# EasyEDA schematic 1-Schematic_New Project.json
TITLE: Sheet_1; REV: 1.0; Date: 2021-07-25; Sheet: 1/1; Drawn By: Felipe Grings; Company: Your Company
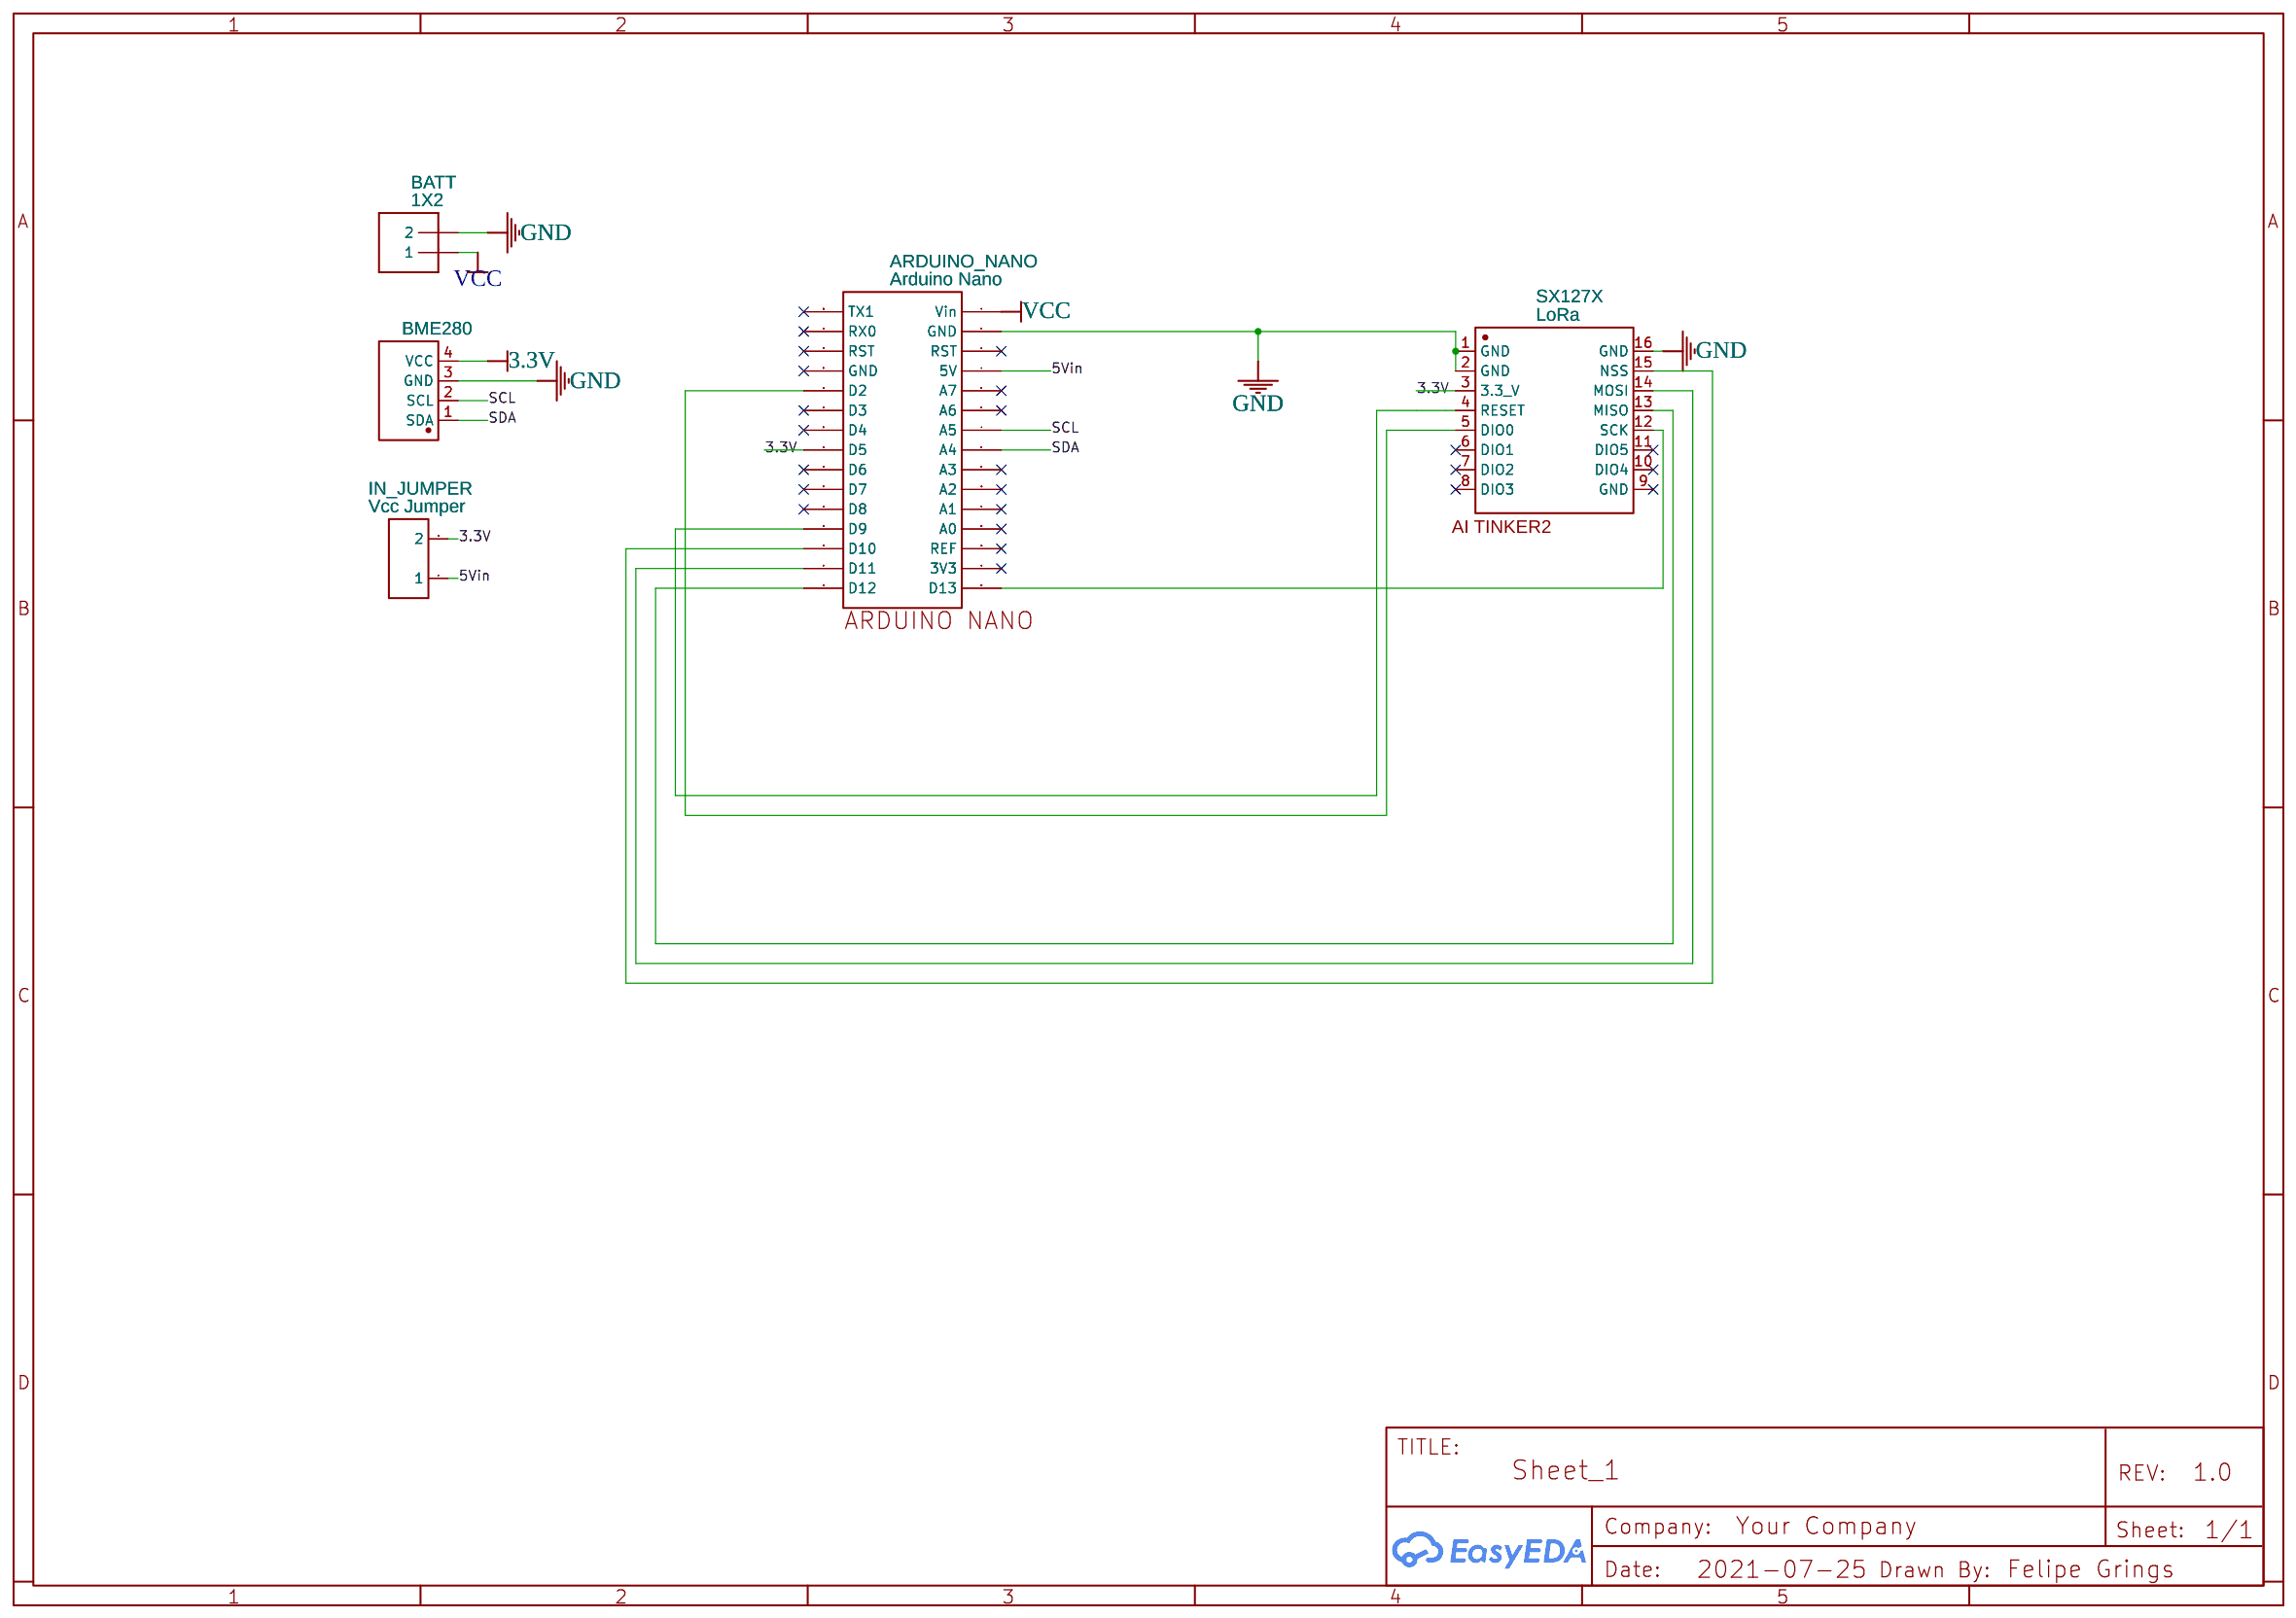
[diagram p0: schematic sheet]

## Parts
ARDUINO_NANO  Arduino Nano  [ARDUINO NANO]
BATT  1X2  [1X2-3.5MM]
IN_JUMPER  Vcc Jumper  [HDR-TH_2P-P2.54-V-M-1]
SDA  BME280  [GYBMEP]
SX127X  LoRa  [AI TINKER2]

## Library data of the parts
ARDUINO_NANO = Arduino Nano: Contributor: hctan22
BATT = 1X2: Contributor: Adafruit
IN_JUMPER = Header-Male-2.54_1x2: Supplier: LCSC; Manufacturer: TE Connectivity; Manufacturer Part: 826629-2; Supplier Part: C86471; JLCPCB Part Class: Extended Part
SDA = GYBMEP: Contributor: MySelf9911
SX127X = LoRa: Supplier: LCSC; Manufacturer: LCX; Manufacturer Part: SX1278; Supplier Part: C87473; Contributor: Mario017; Package Display: Yes

## Nets
3.3V: ARDUINO_NANO.23(D5) IN_JUMPER.2 SDA.4(VCC) SX127X.3(3.3 V)
5Vin: ARDUINO_NANO.4(5V) IN_JUMPER.1
GND: ARDUINO_NANO.2(GND) BATT.2 SDA.3(GND) SX127X.1(GND) SX127X.2(GND) SX127X.16(GND)
VCC: ARDUINO_NANO.1(Vin) BATT.1
SCL: ARDUINO_NANO.7(A5) SDA.2(SCL)
SDA: ARDUINO_NANO.8(A4) SDA.1(SDA)
Net-(ARDUINO_NANO-15): ARDUINO_NANO.15(D13) SX127X.12(SCK)
Net-(ARDUINO_NANO-16): ARDUINO_NANO.16(D12) SX127X.13(MISO)
Net-(ARDUINO_NANO-17): ARDUINO_NANO.17(D11) SX127X.14(MOSI)
Net-(ARDUINO_NANO-18): ARDUINO_NANO.18(D10) SX127X.15(NSS)
Net-(ARDUINO_NANO-19): ARDUINO_NANO.19(D9) SX127X.4(RESET)
Net-(ARDUINO_NANO-26): ARDUINO_NANO.26(D2) SX127X.5(DIO0)

Not connected (* = marked no-connect by the designer): ARDUINO_NANO 3(RST)* 5(A7)* 6(A6)* 9(A3)* 10(A2)* 11(A1)* 12(A0)* 13(REF)* 14(3V3)* 20(D8)* 21(D7)* 22(D6)* 24(D4)* 25(D3)* 27(GND)* 28(RST)* 29(RX0)* 30(TX1)*; SX127X 6(DIO1)* 7(DIO2)* 8(DIO3)* 9(GND)* 10(DIO4)* 11(DIO5)*
